# Altium project CFD_V1.03.PrjPcb (part 2 of 2)

## Sheet DIFF_DRV.SchDoc: ALICE FIT CFD Mezzanine
size 420 x 297 mm; CheckedBy: G.Kasprowicz; Author: INR Moscow; CompanyName: WUT ISE; DrawnBy: Maciej Podgóski; Organization: WUT ISE; Address1: PW ISE; Address2: Nowowiejska 15/19 00-665 Warsaw; Address3: gkasprow@gmail.com; DocumentNumber: 5; Revision: 2; SheetNumber: 5; SheetTotal: 5; ModifiedBy: -; CheckedDate: -; Title2: Differential driver; DivGrp: INR Moscow; Designer: INR Moscow; ModifiedDate: -; ProjectName: Sensor Box
Used 12 times, as channels DIFF_DRV1, DIFF_DRV2, DIFF_DRV3, DIFF_DRV4, DIFF_DRV5, DIFF_DRV6, DIFF_DRV7, DIFF_DRV8, DIFF_DRV9, DIFF_DRV10, DIFF_DRV11, DIFF_DRV12. Parts and nets are listed once, with the designators drawn on the sheet.
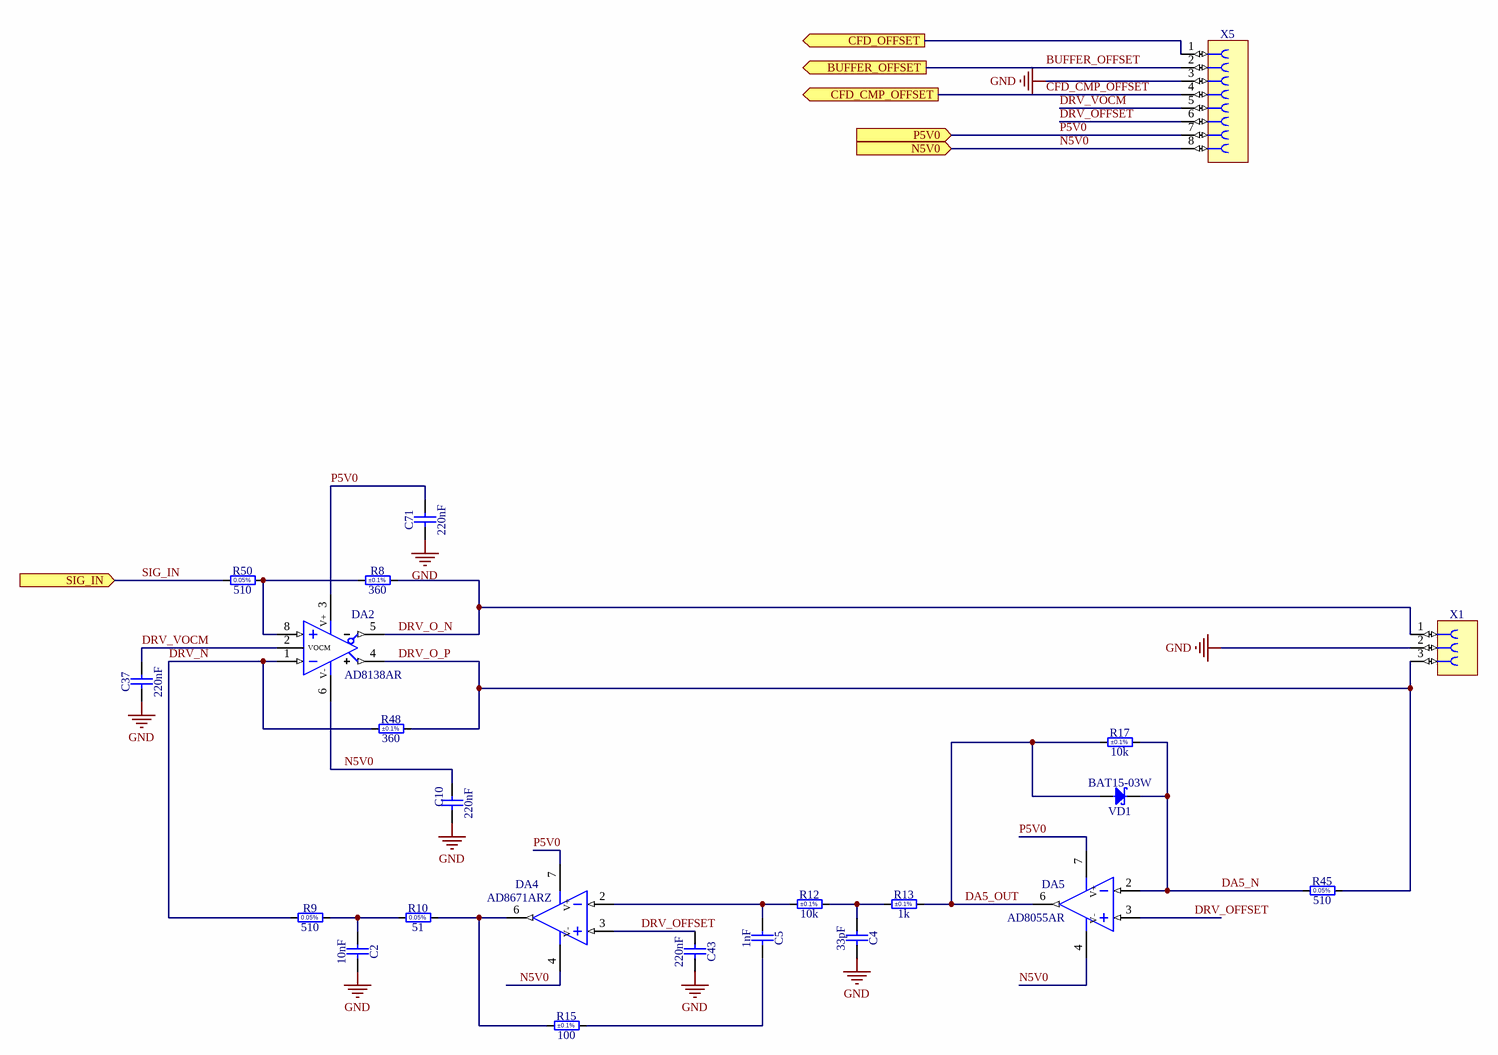
[diagram p3: DIFF_DRV.SchDoc]

### Parts
C2  10nF  [CAPC2012X135N]
C4  33pF  [CAPC2013X115N]
C5  1nF  [CAPC2013X100N]
C10  220nF  [CAPC2012X135N]
C37  220nF  [CAPC2012X135N]
C43  220nF  [CAPC2012X135N]
C71  220nF  [CAPC2012X135N]
DA2  AD8138AR  [SOIC127P600X175-8N]
DA4  AD8671ARZ  [SOIC127P600X175-8N]
DA5  AD8055AR  [SOIC127P600X175-8N]
R8  360  Tolerance: ±0.1%  [RESC2012X60N]
R9  510  [RESC1608X55N]
R10  51  [RESC2012X60N]
R12  10k  Tolerance: ±0.1%  [RESC2012X60N]
R13  1k  Tolerance: ±0.1%  [RESC2012X60N]
R15  100  Tolerance: ±0.1%  [RESC2012X60N]
R17  10k  Tolerance: ±0.1%  [RESC2012X60N]
R45  510  [RESC1608X55N]
R48  360  Tolerance: ±0.1%  [RESC2012X60N]
R50  510  [RESC1608X55N]
VD1  BAT15-03W  [SOD2512X110N]
X1  Socket 3  [SAMTEC_CES-103-01-T-S]  (value not drawn)
X5  Socket 8  [SAMTEC_CES-108-01-T-S]  (value not drawn)

### Ports
BUFFER_OFFSET (out), CFD_CMP_OFFSET (out), CFD_OFFSET (out), N5V0 (in), P5V0 (in), SIG_IN (in)

### Nets
GND: C2.1 C4.1 C10.1 C37.1 C43.1 C71.1 X1.2 X5.3
BUFFER_OFFSET: X5.2 ; port BUFFER_OFFSET
CFD_CMP_OFFSET: X5.4 ; port CFD_CMP_OFFSET
CFD_OFFSET: X5.1 ; port CFD_OFFSET
DA5_N: DA5.2(IN-) R17.1 R45.1 VD1.1(C)
DA5_OUT: DA5.6(OUT) R13.1 R17.2 VD1.2(A)
DRV_N: DA2.1(IN-) R9.2 R48.1
DRV_O_N: DA2.5(VOUT-) R8.2 X1.1
DRV_O_P: DA2.4(VOUT+) R45.2 R48.2 X1.3
DRV_OFFSET: C43.2 DA4.3(IN+) DA5.3(IN+) X5.6
DRV_VOCM: C37.2 DA2.2(VOCM) X5.5
N5V0: C10.2 DA2.6(V-) DA4.4(V-) DA5.4(V-) X5.8 ; port N5V0
P5V0: C71.2 DA2.3(V+) DA4.7(V+) DA5.7(V+) X5.7 ; port P5V0
SIG_IN: R50.1 ; port SIG_IN
NetC2_2: C2.2 R9.1 R10.2
NetC4_2: C4.2 R12.1 R13.2
NetC5_1: C5.1 R15.1
NetC5_2: C5.2 DA4.2(IN-) R12.2
NetDA2_8: DA2.8(IN+) R8.1 R50.2
NetDA4_6: DA4.6(OUT) R10.1 R15.2

### Channels
DIFF_DRV1: designators end in A; ports BUFFER_OFFSET=BUFFER_OFFSET CFD_CMP_OFFSET=CFD_CMP_OFFSET CFD_OFFSET=CFD_OFFSET N5V0=N5V0 P5V0=P5V0 SIG_IN=SIG_IN
DIFF_DRV2: designators end in B; ports BUFFER_OFFSET=BUFFER_OFFSET CFD_CMP_OFFSET=CFD_CMP_OFFSET CFD_OFFSET=CFD_OFFSET N5V0=N5V0 P5V0=P5V0 SIG_IN=SIG_IN
DIFF_DRV3: designators end in C; ports BUFFER_OFFSET=BUFFER_OFFSET CFD_CMP_OFFSET=CFD_CMP_OFFSET CFD_OFFSET=CFD_OFFSET N5V0=N5V0 P5V0=P5V0 SIG_IN=SIG_IN
DIFF_DRV4: designators end in D; ports BUFFER_OFFSET=BUFFER_OFFSET CFD_CMP_OFFSET=CFD_CMP_OFFSET CFD_OFFSET=CFD_OFFSET N5V0=N5V0 P5V0=P5V0 SIG_IN=SIG_IN
DIFF_DRV5: designators end in E; ports BUFFER_OFFSET=BUFFER_OFFSET CFD_CMP_OFFSET=CFD_CMP_OFFSET CFD_OFFSET=CFD_OFFSET N5V0=N5V0 P5V0=P5V0 SIG_IN=SIG_IN
DIFF_DRV6: designators end in F; ports BUFFER_OFFSET=BUFFER_OFFSET CFD_CMP_OFFSET=CFD_CMP_OFFSET CFD_OFFSET=CFD_OFFSET N5V0=N5V0 P5V0=P5V0 SIG_IN=SIG_IN
DIFF_DRV7: designators end in G; ports BUFFER_OFFSET=BUFFER_OFFSET CFD_CMP_OFFSET=CFD_CMP_OFFSET CFD_OFFSET=CFD_OFFSET N5V0=N5V0 P5V0=P5V0 SIG_IN=SIG_IN
DIFF_DRV8: designators end in H; ports BUFFER_OFFSET=BUFFER_OFFSET CFD_CMP_OFFSET=CFD_CMP_OFFSET CFD_OFFSET=CFD_OFFSET N5V0=N5V0 P5V0=P5V0 SIG_IN=SIG_IN
DIFF_DRV9: designators end in I; ports BUFFER_OFFSET=BUFFER_OFFSET CFD_CMP_OFFSET=CFD_CMP_OFFSET CFD_OFFSET=CFD_OFFSET N5V0=N5V0 P5V0=P5V0 SIG_IN=SIG_IN
DIFF_DRV10: designators end in J; ports BUFFER_OFFSET=BUFFER_OFFSET CFD_CMP_OFFSET=CFD_CMP_OFFSET CFD_OFFSET=CFD_OFFSET N5V0=N5V0 P5V0=P5V0 SIG_IN=SIG_IN
DIFF_DRV11: designators end in K; ports BUFFER_OFFSET=BUFFER_OFFSET CFD_CMP_OFFSET=CFD_CMP_OFFSET CFD_OFFSET=CFD_OFFSET N5V0=N5V0 P5V0=P5V0 SIG_IN=SIG_IN
DIFF_DRV12: designators end in L; ports BUFFER_OFFSET=BUFFER_OFFSET CFD_CMP_OFFSET=CFD_CMP_OFFSET CFD_OFFSET=CFD_OFFSET N5V0=N5V0 P5V0=P5V0 SIG_IN=SIG_IN

### Notes on the sheet
- Project/Equipment
- Document
- Designer
- Drawn by
- Check.by
- Copyright WUT ISE 2024.
  This documentation describes Open Hardware and is licensed under the CERN OHL v.2. You may redistribute and modify this documentation under the terms of the CERN OHL v.2. (http://ohwr.org/CERNOHL). This documentation is distributed WITHOUT ANY EXPRESS OR IMPLIED WARRANTY, INCLUDING OF MERCHANTABILITY, SATISFACTORY QUALITY AND FITNESS FOR A PARTICULAR PURPOSE. Please see the CERN OHL v.2 for applicable conditions.
- Contact
- File
- Last Mod.
- Print Date
- Sheet
- Size
- A3
- of
- Rev
- (in symbol R0603_510R_0.1%_0.1W_10PPM) 0.05%
- (in symbol R0805_51R_0.05%_0.125W_10PPM) 0.05%

### Library data of the parts
C2 = CC0805_10NF_50V_2%_C0G: Non-polarised capacitor; Part Description: SMD Multilayer Chip Ceramic Capacitor; Manufacturer: GENERIC; Manufacturer1 Part Number: 0805N103G500CT; Voltage: 50V; TC: C0G/NP0; Tolerance: ±2%; Part Number: CC0805_10NF_50V_2%_C0G; Component Kind: Standard; Component Type: Standard; Pin Count: 2; Value: 10nF; Status: None; Manufacturer Part Number: CC0805_10NF_50V_2%_C0G; Case: 0805; Mounted: Yes; Socket: No; SMD: Yes; Sense: No; Manufacturer1 Example: Walsin Technology Corporation; Manufacturer1 ComponentHeight: 1.35mm; HelpURL: \\cern.ch\dfs\Applications\Altium\Datasheets\CC0805_C0G_Walsin.pdf; Author: CERN DEM HF; CreateDate: 15.04.2024; LatestRevisionDate: 15.04.2024
C4 = CC0805_33PF_200V_1%_NP0: Non-polarised capacitor; Part Description: SMD Multilayer Chip Ceramic Capacitor; Manufacturer: GENERIC; Manufacturer1 Part Number: KGQ21HCG2D330FT; Voltage: 200V; TC: C0G/NP0; Tolerance: ±1%; Part Number: CC0805_33PF_200V_1%_NP0; Component Kind: Standard; Component Type: Standard; Pin Count: 2; Value: 33pF; Status: None; Manufacturer Part Number: CC0805_33PF_200V_1%_NP0; Case: 0805; Mounted: Yes; Socket: No; SMD: Yes; Sense: No; Manufacturer1 Example: AVX; Manufacturer1 ComponentHeight: 1.15mm; HelpURL: \\cern.ch\dfs\Applications\Altium\Datasheets\CC0805_NP0_AVX_KGQ.pdf; Author: CERN DEM HF; CreateDate: 15.04.2024; LatestRevisionDate: 15.04.2024
C5 = CC0805_1NF_25V_1%_C0G: Non-polarised capacitor; Part Description: SMD Multilayer Chip Ceramic Capacitor; Manufacturer: GENERIC; Manufacturer1 Part Number: C0805C102F3GACTU; Voltage: 25V; TC: C0G/NP0; Tolerance: ±1%; Part Number: CC0805_1NF_25V_1%_C0G; Component Kind: Standard; Component Type: Standard; Pin Count: 2; Value: 1nF; Status: None; Manufacturer Part Number: CC0805_1NF_25V_1%_C0G; Case: 0805; Mounted: Yes; Socket: No; SMD: Yes; Sense: No; Manufacturer1 Example: KEMET; Manufacturer1 ComponentHeight: 0.88mm; HelpURL: \\cern.ch\dfs\Applications\Altium\Datasheets\CC0805_C0G_KEMET_(Commercial Grade).pdf; Author: CERN DEM JLC; CreateDate: 11.03.2015; LatestRevisionDate: 11.03.2015
C10 C37 C43 C71 = CC0805_220NF_50V_10%_X7R: Non-polarised capacitor; Part Description: SMD Multilayer Chip Ceramic Capacitor; Manufacturer: GENERIC; Manufacturer1 Part Number: GRM21BR71H224KA01L; Voltage: 50V; TC: X7R; Tolerance: ±10%; Part Number: CC0805_220NF_50V_10%_X7R; Component Kind: Standard; Component Type: Standard; Pin Count: 2; Value: 220nF; Status: Preferred; Manufacturer Part Number: CC0805_220NF_50V_10%_X7R; Case: 0805; Mounted: Yes; Socket: No; SMD: Yes; Sense: No; Manufacturer1 Example: MURATA; Manufacturer1 ComponentHeight: 1.35mm; HelpURL: \\cern.ch\dfs\Applications\Altium\Datasheets\CC0805_X7R_MURATA.pdf; Author: CERN DEM JLC; CreateDate: 03.12.2007; LatestRevisionDate: 03.12.2007
DA2 = AD8138AR: Differential Amplifier; Part Description: Low Distortion Differential ADC Driver; Manufacturer: ANALOG DEVICES; PressFit: No; Bonding: No; Part Number: AD8138AR; Component Kind: Standard; Component Type: Standard; Device: AD8138AR; PackageDescription: SOIC 8, Pitch 1.27mm - Body 4x5mm, IPC Medium Density; Status: Not recommended; Manufacturer Part Number: AD8138AR; Pin Count: 7; Case: SOIC8; Mounted: Yes; Socket: No; SMD: Yes; Sense: No; ComponentHeight: 1.75mm; Author: CERN DEM JLC; HelpURL: \\cern.ch\dfs\Applications\Altium\Datasheets\AD8138AR.pdf; CreateDate: 24.11.2008; LatestRevisionDate: 24.11.2008
DA4 = AD8671ARZ: Operational Amplifier; Part Description: Precision, Very Low Noise, Low Input Bias Current Operational Amplifier; Manufacturer: ANALOG DEVICES; PressFit: No; Bonding: No; Part Number: AD8671ARZ; Component Kind: Standard; Component Type: Standard; Device: AD8671ARZ; PackageDescription: SOIC 8, Pitch 1.27mm - Body 4x5mm, IPC Medium Density; Manufacturer Part Number: AD8671AR; Pin Count: 8; Case: SOIC8; Mounted: Yes; Socket: No; SMD: Yes; Sense: No; ComponentHeight: 1.75mm; Author: CERN DEM JLC; HelpURL: \\cern.ch\dfs\Applications\Altium\Datasheets\AD8671ARZ.pdf; CreateDate: 17.06.2014; LatestRevisionDate: 31.03.2022
DA5 = AD8055AR: Operational Amplifier; Part Description: Low Cost, 300 MHz Voltage Feedback Amplifier; Manufacturer: ANALOG DEVICES; PressFit: No; Bonding: No; Part Number: AD8055AR; Component Kind: Standard; Component Type: Standard; Device: AD8055AR; PackageDescription: SOIC 8, Pitch 1.27mm - Body 4x5mm, IPC Medium Density; Manufacturer Part Number: AD8055AR; Pin Count: 8; Case: SOIC8; Mounted: Yes; Socket: No; SMD: Yes; Sense: No; ComponentHeight: 1.75mm; Author: CERN DEM HF; HelpURL: \\cern.ch\dfs\Applications\Altium\Datasheets\AD8055.pdf; CreateDate: 15.04.2024; LatestRevisionDate: 15.04.2024
R8 R48 = R0805_360R_0.1%_0.125W_10PPM: Resistor - 0.1%; Part Description: Thin Film Chip Resistor; Manufacturer: GENERIC; Manufacturer1 Part Number: RT0805BRB07360RL; Power: 0.125W; TC: ±10ppm; PressFit: No; Part Number: R0805_360R_0.1%_0.125W_10PPM; Component Kind: Standard; Component Type: Standard; Pin Count: 2; Value: 360; Status: Not Recommended; Manufacturer Part Number: R0805_360R_0.1%_0.125W_10PPM; Case: 0805; Mounted: Yes; Sense: No; Socket: No; SMD: Yes; Manufacturer1 Example: YAGEO PHYCOMP; Manufacturer1 ComponentHeight: 0.6mm; HelpURL: \\cern.ch\dfs\Applications\Altium\Datasheets\R0805_YAGEO_RT.pdf; Author: CERN DEM HF; CreateDate: 11.07.2022; LatestRevisionDate: 11.07.2022
R9 R45 R50 = R0603_510R_0.1%_0.1W_10PPM: Resistor - 0.05%; Part Description: Thin Film Chip Resistor; Manufacturer: GENERIC; Manufacturer1 Part Number: RG1608N-511-W-T1; Power: 0.1W; TC: ±10ppm/°C; Tolerance: ±0.1%; PressFit: No; Part Number: R0603_510R_0.1%_0.1W_10PPM; Component Kind: Standard; Component Type: Standard; Pin Count: 2; Value: 510; Status: Not Recommended; Manufacturer Part Number: R0603_510R_0.1%_0.1W_10PPM; Case: 0805; Mounted: Yes; Sense: No; Socket: No; SMD: Yes; Manufacturer1 Example: SUSUMU; Manufacturer1 ComponentHeight: 0.5mm; HelpURL: \\cern.ch\dfs\Applications\Altium\Datasheets\R0603_SUSUMU_RG.pdf; Author: CERN DEM HF; CreateDate: 25.04.2024; LatestRevisionDate: 25.04.2024
R10 = R0805_51R_0.05%_0.125W_10PPM: Resistor - 0.05%; Part Description: Thin Film Chip Resistor; Manufacturer: GENERIC; Manufacturer1 Part Number: RG2012N-510-W-T1; Power: 0.1W; TC: ±10ppm/°C; Tolerance: ±0.1%; PressFit: No; Part Number: R0805_51R_0.05%_0.125W_10PPM; Component Kind: Standard; Component Type: Standard; Pin Count: 2; Value: 51; Status: Not Recommended; Manufacturer Part Number: R0805_51R_0.05%_0.125W_10PPM; Case: 0805; Mounted: Yes; Sense: No; Socket: No; SMD: Yes; Manufacturer1 Example: SUSUMU; Manufacturer1 ComponentHeight: 0.5mm; HelpURL: \\cern.ch\dfs\Applications\Altium\Datasheets\R0805_SUSUMU_RG.pdf; Author: CERN DEM HF; CreateDate: 25.04.2024; LatestRevisionDate: 25.04.2024
R12 R17 = R0805_10K_0.1%_0.1W_10PPM: Resistor - 0.1%; Part Description: Thin Film Chip Resistor; Manufacturer: GENERIC; Manufacturer1 Part Number: RN73C2A10KBTG; Power: 0.1W; TC: ±10ppm; PressFit: No; Part Number: R0805_10K_0.1%_0.1W_10PPM; Component Kind: Standard; Component Type: Standard; Pin Count: 2; Value: 10k; Status: Not Recommended; Manufacturer Part Number: R0805_10K_0.1%_0.1W_10PPM; Case: 0805; Mounted: Yes; Sense: No; Socket: No; SMD: Yes; Manufacturer1 Example: TYCO HOLSWORTHY; Manufacturer1 ComponentHeight: 0.6mm; HelpURL: \\cern.ch\dfs\Applications\Altium\Datasheets\R0805_Tyco_RN73.pdf; Author: CERN DEM JLC; CreateDate: 03.12.2007; LatestRevisionDate: 13.03.2008
R13 = R0805_1K_0.1%_0.1W_10PPM: Resistor - 0.1%; Part Description: Thin Film Chip Resistor; Manufacturer: GENERIC; Manufacturer1 Part Number: RN73C2A1K0BTG; Power: 0.1W; TC: ±10ppm; PressFit: No; Part Number: R0805_1K_0.1%_0.1W_10PPM; Component Kind: Standard; Component Type: Standard; Pin Count: 2; Value: 1k; Status: Not Recommended; Manufacturer Part Number: R0805_1K_0.1%_0.1W_10PPM; Case: 0805; Mounted: Yes; Sense: No; Socket: No; SMD: Yes; Manufacturer1 Example: TYCO HOLSWORTHY; Manufacturer1 ComponentHeight: 0.6mm; HelpURL: \\cern.ch\dfs\Applications\Altium\Datasheets\R0805_TYCO_RN73.pdf; Author: CERN DEM JLC; CreateDate: 28.05.2013; LatestRevisionDate: 28.05.2013
R15 = R0805_100R_0.1%_0.1W_10PPM: Resistor - 0.1%; Part Description: Thin Film Chip Resistor; Manufacturer: GENERIC; Manufacturer1 Part Number: RN73C2A100RBTG; Power: 0.1W; TC: ±10ppm; PressFit: No; Part Number: R0805_100R_0.1%_0.1W_10PPM; Component Kind: Standard; Component Type: Standard; Pin Count: 2; Value: 100; Status: Not Recommended; Manufacturer Part Number: R0805_100R_0.1%_0.1W_10PPM; Case: 0805; Mounted: Yes; Sense: No; Socket: No; SMD: Yes; Manufacturer1 Example: TYCO HOLSWORTHY; Manufacturer1 ComponentHeight: 0.6mm; HelpURL: \\cern.ch\dfs\Applications\Altium\Datasheets\R0805_Tyco_RN73.pdf; Author: CERN DEM JLC; CreateDate: 03.12.2007; LatestRevisionDate: 13.03.2008
VD1 = BAT15-03W: Schottky Diode; Part Description: Single Silicon RF Schottky Diode; Manufacturer: INFINEON; Device: BAT60A; Voltage: 4V; Power: 100mA; PressFit: No; Bonding: No; Part Number: BAT15-03W; Component Kind: Standard; Component Type: Standard; PackageDescription: Small Outline Diode (SOD-323), 1.70mm W X 1.25mm L X 1.10mm H body,  IPC Medium Density; Manufacturer Part Number: BAT15-03W; Pin Count: 2; Case: SOD-323; Mounted: Yes; Socket: No; SMD: Yes; Sense: No; ComponentHeight: 1.1mm; HelpURL: \\cern.ch\dfs\Applications\Altium\Datasheets\BAT15-03W.pdf; Author: CERN DEM HF; CreateDate: 15.04.2024; LatestRevisionDate: 15.04.2024
X1 = SAMTEC_CES-103-01-L-S: Connector 3 Female; Part Description: 3 Contacts, Pitch 2.54mm, Single Row Through Mount Straight Socket (Lead Length 3.25mm); Manufacturer: SAMTEC; PressFit: No; Part Number: SAMTEC_CES-103-01-L-S; Component Kind: Standard; Component Type: Standard; Pin Count: 3; Family: Socket 3; Mounted: Yes; Socket: No; SMD: No; Sense: No; Status: None; Manufacturer Part Number: CES-103-01-L-S; ComponentHeight: 5.08mm; HelpURL: \\cern.ch\dfs\Applications\Altium\Datasheets\SAMTEC_CES-103-01-T-S.pdf; Author: CERN DEM HF; CreateDate: 25.04.2024; LatestRevisionDate: 25.04.2024
X5 = SAMTEC_CES-108-01-L-S: Connector 8 Female; Part Description: 8 Contacts, Pitch 2.54mm, Single Row Through Mount Straight Socket (Lead Length 3.25mm); Manufacturer: SAMTEC; PressFit: No; Part Number: SAMTEC_CES-108-01-L-S; Component Kind: Standard; Component Type: Standard; Pin Count: 8; Family: Socket 8; Mounted: Yes; Socket: No; SMD: No; Sense: No; Status: None; Manufacturer Part Number: CES-108-01-L-S; ComponentHeight: 5.08mm; HelpURL: \\cern.ch\dfs\Applications\Altium\Datasheets\SAMTEC_CES-108-01-T-S.pdf; Author: CERN DEM HF; CreateDate: 25.04.2024; LatestRevisionDate: 25.04.2024

## Sheet CFD_Timing.SchDoc: ALICE FIT CFD Mezzanine
size 420 x 297 mm; CheckedBy: G.Kasprowicz; Author: INR Moscow; CompanyName: WUT ISE; DrawnBy: Maciej Podgóski; Organization: WUT ISE; Address1: PW ISE; Address2: Nowowiejska 15/19 00-665 Warsaw; Address3: gkasprow@gmail.com; DocumentNumber: 2; Revision: 2; SheetNumber: 2; SheetTotal: 5; ModifiedBy: -; CheckedDate: -; Title2: Constant Fraction Disciriminator; DivGrp: WUT ISE; Designer: INR Moscow; ModifiedDate: -; ProjectName: Sensor Box
Used 12 times, as channels CFD_T1, CFD_T2, CFD_T3, CFD_T4, CFD_T5, CFD_T6, CFD_T7, CFD_T8, CFD_T9, CFD_T10, CFD_T11, CFD_T12. Parts and nets are listed once, with the designators drawn on the sheet.
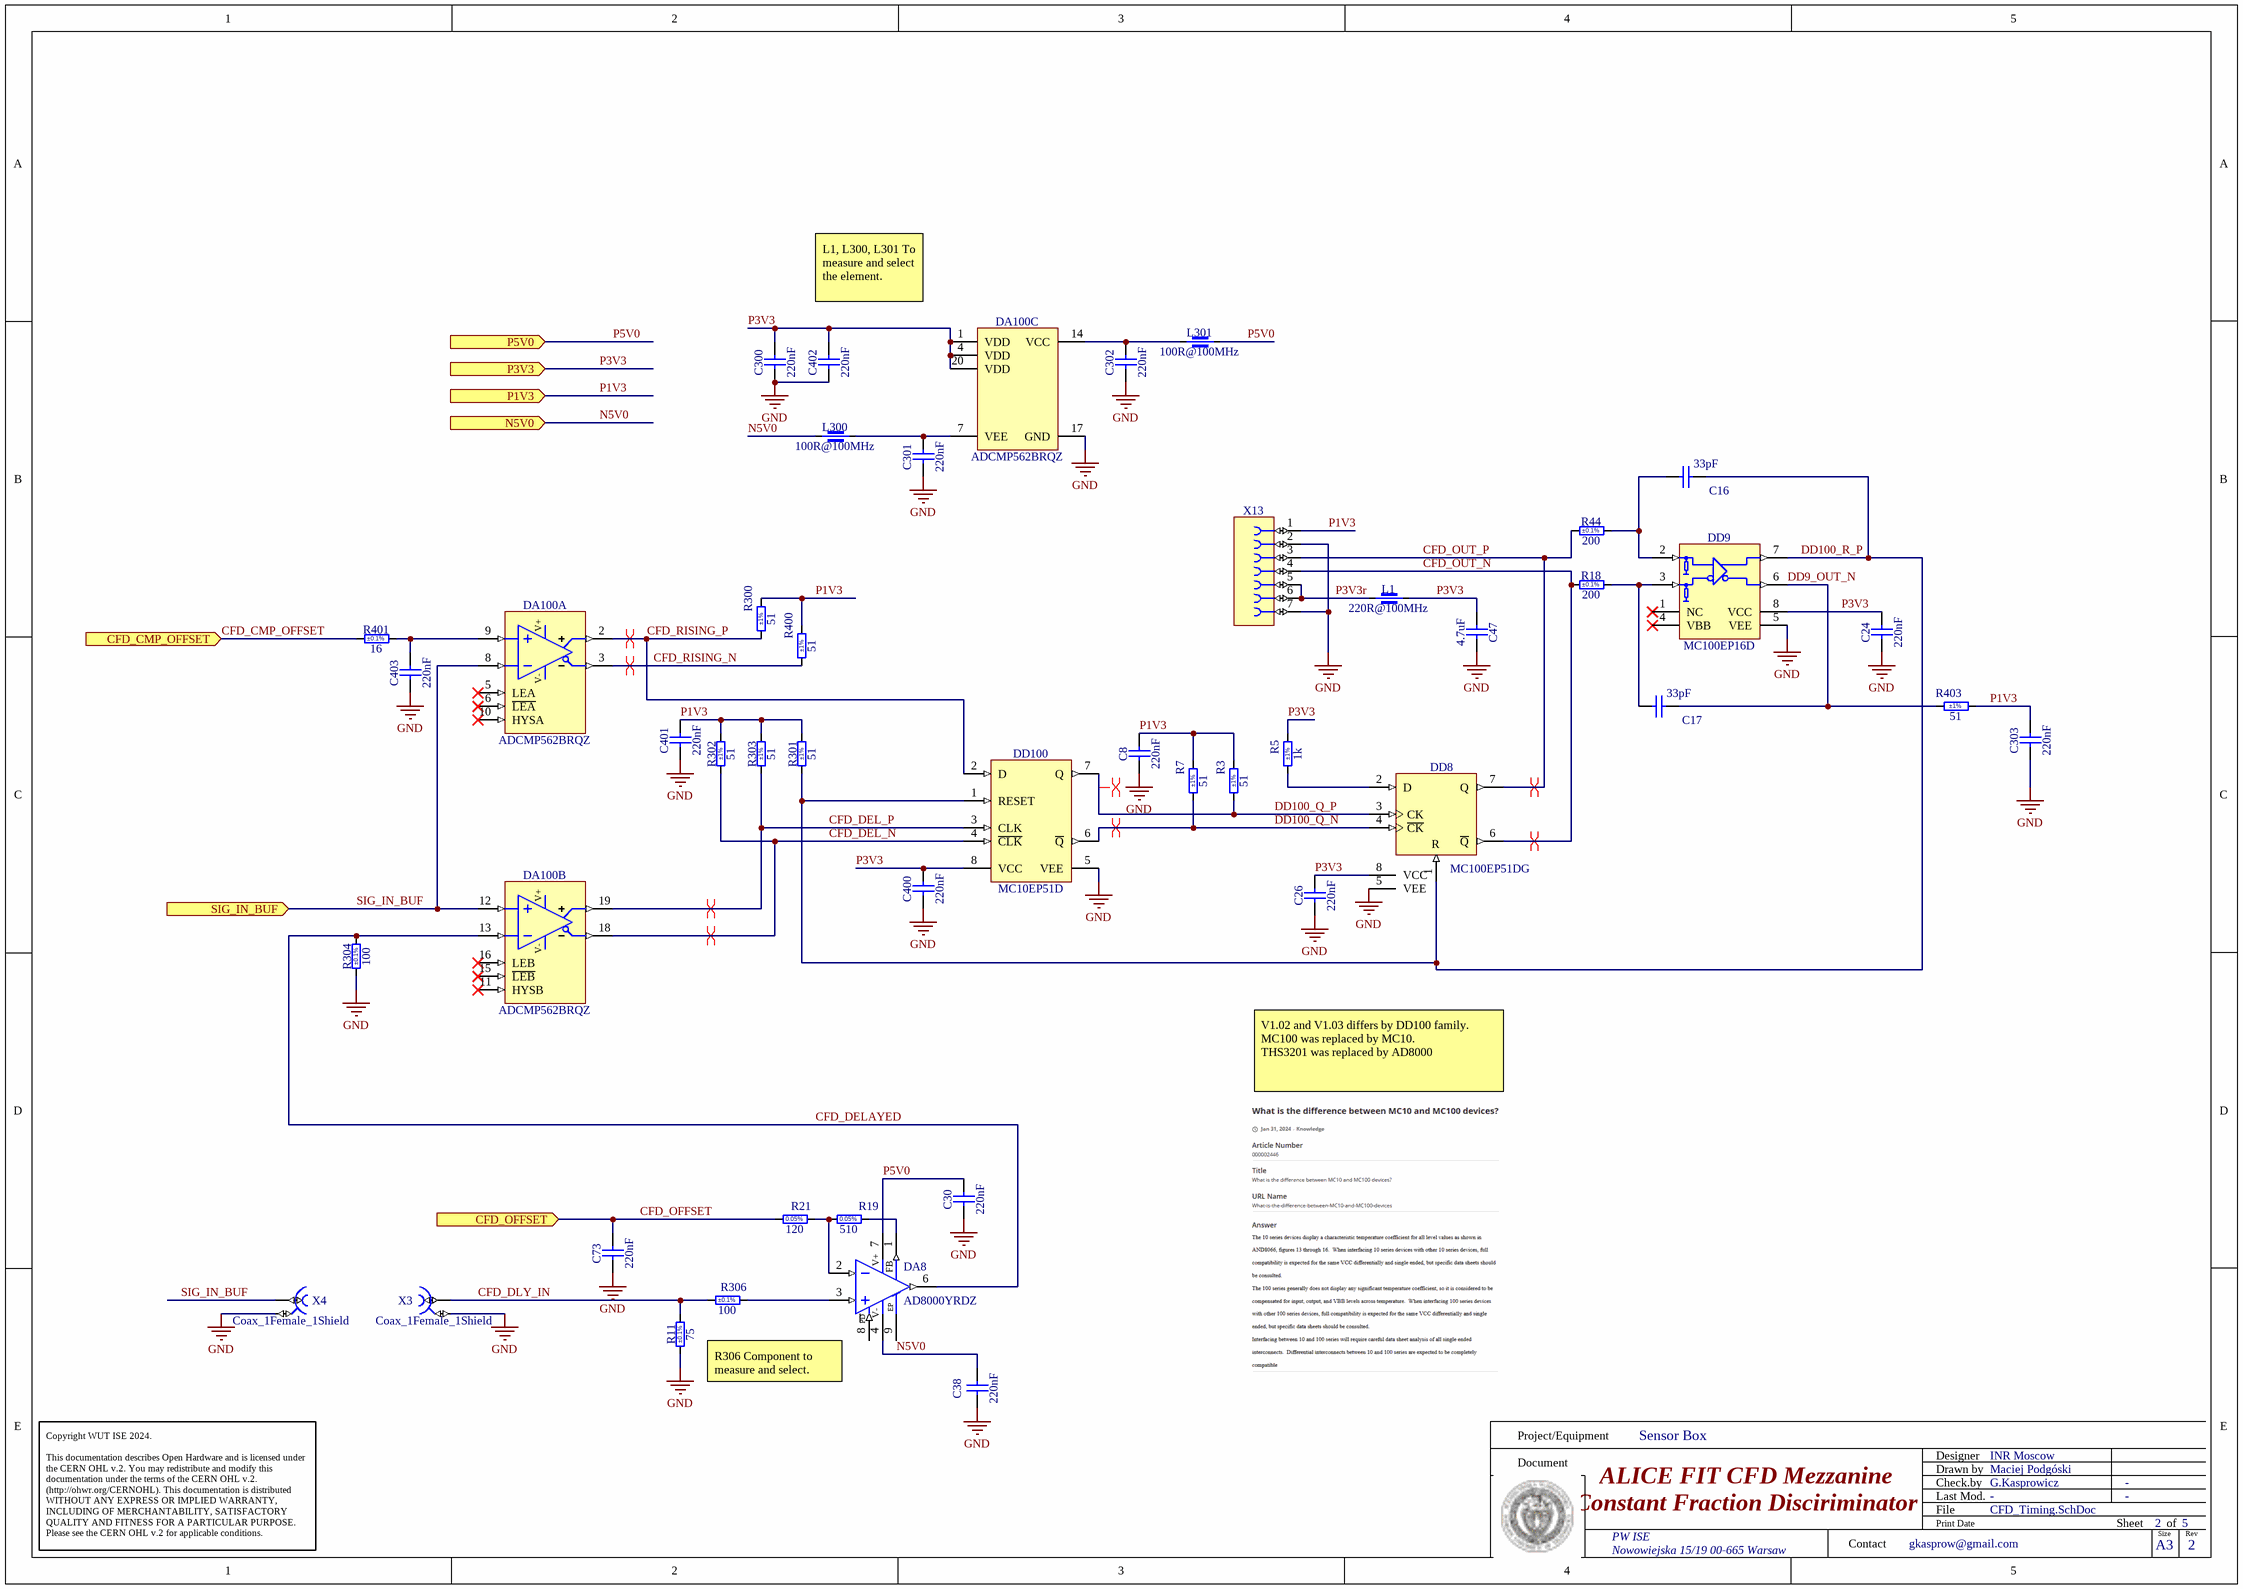
[diagram p4: CFD_Timing.SchDoc]

### Parts
C8  220nF  [CAPC2012X135N]
C16  33pF  [CAPC2012X135N]
C17  33pF  [CAPC2012X135N]
C24  220nF  [CAPC2012X135N]
C26  220nF  [CAPC2012X135N]
C30  220nF  [CAPC2012X135N]
C38  220nF  [CAPC2012X135N]
C47  4.7uF  [CAPC3216X180N]
C73  220nF  [CAPC2012X135N]
C300  220nF  [CAPC1608X87N]
C301  220nF  [CAPC1608X87N]
C302  220nF  [CAPC1608X87N]
C303  220nF  [CAPC2012X135N]
C400  220nF  [CAPC2012X135N]
C401  220nF  [CAPC2012X135N]
C402  220nF  [CAPC1608X87N]
C403  220nF  [CAPC1608X87N]
DA8  AD8000YRDZ  [SOIC127P600X175-9N-S229]
DA100  ADCMP562BRQZ  [SOP63P600X175-20AN]  (parts A,B,C of 3)
DD8  MC100EP51DG  [SOIC127P600X175-8N]
DD9  MC100EP16D  [SOIC127P600X175-8N]
DD100  MC10EP51D  [SOP65P490X110-8N]
L1  220R@100MHz  [INDC2012X105N]
L300  100R@100MHz  [INDC1608X75N]
L301  100R@100MHz  [INDC1608X75N]
R3  51  Tolerance: ±1%  [RESC2012X60N]
R5  1k  Tolerance: ±1%  [RESC2012X60N]
R7  51  Tolerance: ±1%  [RESC2012X60N]
R11  75  Tolerance: ±0.1%  [RESC1608X55N]
R18  200  Tolerance: ±0.1%  [RESC2012X60N]
R19  510  [RESC1608X55N]
R21  120  [RESC1608X55N]
R44  200  Tolerance: ±0.1%  [RESC2012X60N]
R300  51  Tolerance: ±1%  [RESC2012X60N]
R301  51  Tolerance: ±1%  [RESC2012X60N]
R302  51  Tolerance: ±1%  [RESC2012X60N]
R303  51  Tolerance: ±1%  [RESC2012X60N]
R304  100  Tolerance: ±0.1%  [RESC1608X55N]
R306  100  Tolerance: ±0.1%  [RESC1005X35N]
R400  51  Tolerance: ±1%  [RESC2012X60N]
R401  16  Tolerance: ±0.1%  [RESC1608X64N]
R403  51  Tolerance: ±1%  [RESC2012X60N]
X3  Coax_1Female_1Shield  [SAMTEC_MMCX-J-P-H-ST-TH1]
X4  Coax_1Female_1Shield  [SAMTEC_MMCX-J-P-H-ST-TH1]
X13  Socket 7  [SAMTEC_CES-107-01-T-S]  (value not drawn)

### Ports
CFD_CMP_OFFSET (in), CFD_OFFSET (in), N5V0 (in), P1V3 (in), P3V3 (in), P5V0 (in), SIG_IN_BUF (in)

### Nets
GND: C8.1 C24.1 C26.1 C30.1 C38.1 C47.1 C73.1 C300.1 C301.1 C302.1 C303.1 C400.1 C401.1 C402.1 C403.1 DA100.17(GND) DD8.5(VEE) DD9.5(VEE) DD100.5(VEE) R11.1 R304.1 X3.2 X4.2 X13.2 X13.7
CFD_CMP_OFFSET: R401.1 ; port CFD_CMP_OFFSET
CFD_DEL_N: DA100.18(~{QB}) DD100.4(~{CLK}) R302.1
CFD_DEL_P: DA100.19(QB) DD100.3(CLK) R303.1
CFD_DELAYED: DA8.6(OUT) DA100.13(-INB) R304.2
CFD_DLY_IN: R11.2 R306.1 X3.1
CFD_OFFSET: C73.2 R21.1 ; port CFD_OFFSET
CFD_OUT_N: DD8.6(~{Q}) R18.1 X13.4
CFD_OUT_P: DD8.7(Q) R44.1 X13.3
CFD_RISING_N: DA100.3(~{QA}) R400.1
CFD_RISING_P: DA100.2(QA) DD100.2(D) R300.1
DD9_OUT_N: C17.1 DD9.6(~{Q}) R403.1
DD100_Q_N: DD8.4(~{CK}) DD100.6(~{Q}) R7.1
DD100_Q_P: DD8.3(CK) DD100.7(Q) R3.1
DD100_R_P: C16.1 DD8.1(R) DD9.7(Q) DD100.1(RESET) R301.1
N5V0: C38.2 DA8.4(V-) L300.1 ; port N5V0
P1V3: C8.2 C303.2 C401.2 R3.2 R7.2 R300.2 R301.2 R302.2 R303.2 R400.2 R403.2 X13.1 ; port P1V3
P3V3: C24.2 C26.2 C47.2 C300.2 C400.2 C402.2 DA100.1(VDD) DA100.4(VDD) DA100.20(VDD) DD8.8(VCC) DD9.8(VCC) DD100.8(VCC) L1.1 R5.2 ; port P3V3
P3V3r: L1.2 X13.5 X13.6
P5V0: C30.2 DA8.7(V+) L301.2 ; port P5V0
SIG_IN_BUF: DA100.8(-INA) DA100.12(+INB) X4.1 ; port SIG_IN_BUF
NetC16_2: C16.2 DD9.2(D0) R44.2
NetC17_2: C17.2 DD9.3(~{D0}) R18.2
NetC301_2: C301.2 DA100.7(VEE) L300.2
NetC302_2: C302.2 DA100.14(VCC) L301.1
NetC403_2: C403.2 DA100.9(+INA) R401.2
NetDA8_1: DA8.1(FB) R19.2
NetDA8_2: DA8.2(IN-) R19.1 R21.2
NetDA8_3: DA8.3(IN+) R306.2
NetDD8_2: DD8.2(D) R5.1

Not connected (* = marked no-connect by the designer): DA8 8(~{DS}) 9(EP); DA100 5(LEA)* 6(~{LEA})* 10(HYSA)* 11(HYSB)* 15(~{LEB})* 16(LEB)*; DD9 1(NC)* 4(VBB)*

### Channels
CFD_T1: designators end in A; ports CFD_CMP_OFFSET=CFD_CMP_OFFSET CFD_OFFSET=CFD_OFFSET N5V0=N5V0 P1V3=P1V3 P3V3=P3V3 P5V0=P5V0 SIG_IN_BUF=SIG_IN_BUF
CFD_T2: designators end in B; ports CFD_CMP_OFFSET=CFD_CMP_OFFSET CFD_OFFSET=CFD_OFFSET N5V0=N5V0 P1V3=P1V3 P3V3=P3V3 P5V0=P5V0 SIG_IN_BUF=SIG_IN_BUF
CFD_T3: designators end in C; ports CFD_CMP_OFFSET=CFD_CMP_OFFSET CFD_OFFSET=CFD_OFFSET N5V0=N5V0 P1V3=P1V3 P3V3=P3V3 P5V0=P5V0 SIG_IN_BUF=SIG_IN_BUF
CFD_T4: designators end in D; ports CFD_CMP_OFFSET=CFD_CMP_OFFSET CFD_OFFSET=CFD_OFFSET N5V0=N5V0 P1V3=P1V3 P3V3=P3V3 P5V0=P5V0 SIG_IN_BUF=SIG_IN_BUF
CFD_T5: designators end in E; ports CFD_CMP_OFFSET=CFD_CMP_OFFSET CFD_OFFSET=CFD_OFFSET N5V0=N5V0 P1V3=P1V3 P3V3=P3V3 P5V0=P5V0 SIG_IN_BUF=SIG_IN_BUF
CFD_T6: designators end in F; ports CFD_CMP_OFFSET=CFD_CMP_OFFSET CFD_OFFSET=CFD_OFFSET N5V0=N5V0 P1V3=P1V3 P3V3=P3V3 P5V0=P5V0 SIG_IN_BUF=SIG_IN_BUF
CFD_T7: designators end in G; ports CFD_CMP_OFFSET=CFD_CMP_OFFSET CFD_OFFSET=CFD_OFFSET N5V0=N5V0 P1V3=P1V3 P3V3=P3V3 P5V0=P5V0 SIG_IN_BUF=SIG_IN_BUF
CFD_T8: designators end in H; ports CFD_CMP_OFFSET=CFD_CMP_OFFSET CFD_OFFSET=CFD_OFFSET N5V0=N5V0 P1V3=P1V3 P3V3=P3V3 P5V0=P5V0 SIG_IN_BUF=SIG_IN_BUF
CFD_T9: designators end in I; ports CFD_CMP_OFFSET=CFD_CMP_OFFSET CFD_OFFSET=CFD_OFFSET N5V0=N5V0 P1V3=P1V3 P3V3=P3V3 P5V0=P5V0 SIG_IN_BUF=SIG_IN_BUF
CFD_T10: designators end in J; ports CFD_CMP_OFFSET=CFD_CMP_OFFSET CFD_OFFSET=CFD_OFFSET N5V0=N5V0 P1V3=P1V3 P3V3=P3V3 P5V0=P5V0 SIG_IN_BUF=SIG_IN_BUF
CFD_T11: designators end in K; ports CFD_CMP_OFFSET=CFD_CMP_OFFSET CFD_OFFSET=CFD_OFFSET N5V0=N5V0 P1V3=P1V3 P3V3=P3V3 P5V0=P5V0 SIG_IN_BUF=SIG_IN_BUF
CFD_T12: designators end in L; ports CFD_CMP_OFFSET=CFD_CMP_OFFSET CFD_OFFSET=CFD_OFFSET N5V0=N5V0 P1V3=P1V3 P3V3=P3V3 P5V0=P5V0 SIG_IN_BUF=SIG_IN_BUF

### Layout directives
differential pair: CFD_DEL_N_CFD_T1, CFD_DEL_P_CFD_T1, CFD_OUT_N_CFD_T1, CFD_OUT_P_CFD_T1, CFD_RISING_N_CFD_T1, CFD_RISING_P_CFD_T1, DD100_Q_N_CFD_T1, DD100_Q_P_CFD_T1

### Notes on the sheet
- L1, L300, L301 To measure and select the element.
- V1.02 and V1.03 differs by DD100 family. MC100 was replaced by MC10.
  THS3201 was replaced by AD8000
- R306 Component to measure and select.
- Project/Equipment
- Document
- Designer
- Drawn by
- Check.by
- Copyright WUT ISE 2024.
  This documentation describes Open Hardware and is licensed under the CERN OHL v.2. You may redistribute and modify this documentation under the terms of the CERN OHL v.2. (http://ohwr.org/CERNOHL). This documentation is distributed WITHOUT ANY EXPRESS OR IMPLIED WARRANTY, INCLUDING OF MERCHANTABILITY, SATISFACTORY QUALITY AND FITNESS FOR A PARTICULAR PURPOSE. Please see the CERN OHL v.2 for applicable conditions.
- Contact
- File
- Last Mod.
- Print Date
- Sheet
- Size
- A3
- of
- Rev
- (in symbol AD8000YRDZ) PD
- (in symbol ADCMP562BRQZ, part A) V+; V-
- (in symbol ADCMP562BRQZ, part B) V+; V-
- (in symbol R0603_120R_0.05%_0.1W_10PPM) 0.05%
- (in symbol R0603_510R_0.1%_0.1W_10PPM) 0.05%

### Library data of the parts
C8 C24 C26 C30 C38 C73 C303 C400 C401 = CC0805_220NF_50V_10%_X7R: as C10 on sheet DIFF_DRV; Part Number: CC0805_220NF_50V_10%_X7R; Component Kind: Standard; Component Type: Standard; Pin Count: 2; Value: 220nF; Status: Preferred; Manufacturer Part Number: CC0805_220NF_50V_10%_X7R; Case: 0805; Mounted: Yes; Socket: No; SMD: Yes; Sense: No; Manufacturer1 Example: MURATA; Manufacturer1 ComponentHeight: 1.35mm; HelpURL: \\cern.ch\dfs\Applications\Altium\Datasheets\CC0805_X7R_MURATA.pdf; Author: CERN DEM JLC; CreateDate: 03.12.2007; LatestRevisionDate: 03.12.2007
C16 C17 = CC0805_33PF_50V_5%_NP0: Non-polarised capacitor; Part Description: SMD Multilayer Chip Ceramic Capacitor; Manufacturer: GENERIC; Manufacturer1 Part Number: 223886115339; Voltage: 50V; TC: C0G/NP0; Tolerance: ±5%; Part Number: CC0805_33PF_50V_5%_NP0; Component Kind: Standard; Component Type: Standard; Pin Count: 2; Value: 33pF; Status: Preferred; Manufacturer Part Number: CC0805_33PF_50V_5%_NP0; Case: 0805; Mounted: Yes; Socket: No; SMD: Yes; Sense: No; Manufacturer1 Example: PHYCOMP; Manufacturer1 ComponentHeight: 1.35mm; HelpURL: \\cern.ch\dfs\Applications\Altium\Datasheets\CC0805_NP0_PHYCOMP.pdf; Author: CERN DEM JLC; CreateDate: 03.12.2007; LatestRevisionDate: 03.12.2007
C47 = CC1206_4.7UF_25V_10%_X7R: Non-polarised capacitor; Part Description: SMD Multilayer Chip Ceramic Capacitor; Manufacturer: GENERIC; Manufacturer1 Part Number: C1206C475K3RAC; Voltage: 25V; TC: X7R; Tolerance: ±10%; Part Number: CC1206_4.7UF_25V_10%_X7R; Component Kind: Standard; Component Type: Standard; Pin Count: 2; Value: 4.7uF; Status: Preferred; Manufacturer Part Number: CC1206_4.7UF_25V_10%_X7R; Case: 1206; Mounted: Yes; Socket: No; SMD: Yes; Sense: No; Manufacturer1 Example: KEMET; Manufacturer1 ComponentHeight: 1.8mm; HelpURL: \\cern.ch\dfs\Applications\Altium\Datasheets\CC1206_X7R_KEMET.pdf; Author: CERN DEM WB; CreateDate: 25.07.2018; LatestRevisionDate: 25.07.2018
C300-C302 C402 C403 = CC0603_220NF_25V_10%_X7R: Non-polarised capacitor; Part Description: SMD Multilayer Chip Ceramic Capacitor; Manufacturer: GENERIC; Manufacturer1 Part Number: C0603C224K3RACTU; Voltage: 25V; TC: X7R; Tolerance: ±10%; Part Number: CC0603_220NF_25V_10%_X7R; Component Kind: Standard; Component Type: Standard; Pin Count: 2; Value: 220nF; Status: Preferred; Manufacturer Part Number: CC0603_220NF_25V_10%_X7R; Case: 0603; Mounted: Yes; Socket: No; SMD: Yes; Sense: No; Manufacturer1 Example: KEMET; Manufacturer1 ComponentHeight: 0.87mm; HelpURL: \\cern.ch\dfs\Applications\Altium\Datasheets\CC0603_X7R_KEMET.pdf; Author: CERN DEM JLC; CreateDate: 29.10.2014; LatestRevisionDate: 29.10.2014
DA8 = AD8000YRDZ: 1.5 GHz Ultrahigh Speed Operational Amplifier; Manufacturer: ANALOG DEVICES; PressFit: No; Bonding: No; Part Number: AD8000YRDZ; Component Kind: Standard; Component Type: Standard; Device: AD8000YRDZ; PackageDescription: SOIC, 1.27mm Pitch; 8 Pin, 3.90mm W X 4.90mm L X 1.75mm H body (w/Thermal Tab 2.29 X 2.29mm), IPC Medium Density; Part Description: 1.5 GHz Ultrahigh Speed Operational Amplifier; Manufacturer Part Number: AD8000YRD; Pin Count: 9; Case: SOIC8; Mounted: Yes; Socket: No; SMD: Yes; Sense: No; ComponentHeight: 1.75mm; Author: CERN DEM JLC; HelpURL: \\cern.ch\dfs\Applications\Altium\Datasheets\AD8000YRDZ.pdf; CreateDate: 14.05.2013; LatestRevisionDate: 29.03.2022
DA100 = ADCMP562BRQZ: Dual, High Speed PECL Comparators; Part Description: Dual High Speed PECL Comparators; Manufacturer: ANALOG DEVICES; PressFit: No; Bonding: No; Part Number: ADCMP562BRQZ; Component Kind: Standard; Component Type: Standard; Device: ADCMP562BRQZ; PackageDescription: SOP, 0.635mm Pitch; 20 Pin, 3.90mm W X 8.65mm L X 1.75mm H Body, IPC Medium Density; Manufacturer Part Number: ADCMP562BRQ; Pin Count: 20; Case: SSOP20; Mounted: Yes; Socket: No; SMD: Yes; Sense: No; ComponentHeight: 1.75mm; Author: CERN DEM MR; HelpURL: \\cern.ch\dfs\Applications\Altium\Datasheets\ADCMP562BRQZ.pdf; CreateDate: 15.02.2018; LatestRevisionDate: 31.03.2022
DD8 = MC100EP51DG: 3.3V/5V ECL D Flip-Flop with Reset and Differential Clock; Manufacturer: ON SEMICONDUCTOR; PressFit: No; Bonding: No; Part Number: MC100EP51DG; Component Kind: Standard; Component Type: Standard; Device: MC100EP51DG; PackageDescription: SOIC 8, Pitch 1.27mm - Body 4x5mm, IPC Medium Density; Part Description: 3.3V/5V ECL D Flip-Flop with Reset and Differential Clock; Manufacturer Part Number: MC100EP51D; Pin Count: 8; Case: SOIC8; Mounted: Yes; Socket: No; SMD: Yes; Sense: No; ComponentHeight: 1.75mm; Author: CERN DEM JLC; HelpURL: \\cern.ch\dfs\Applications\Altium\Datasheets\MC100EP51DG.pdf; CreateDate: 27.02.2013; LatestRevisionDate: 25.05.2022
DD9 = MC100EP16D: 3.3V / 5V ECL Differential Receiver/Driver with High Gain; Manufacturer: ON SEMICONDUCTOR; PressFit: No; Bonding: No; Part Number: MC100EP16D; Component Kind: Standard; Component Type: Standard; Device: MC100EP16D; PackageDescription: SOIC 8, Pitch 1.27mm - Body 4x5mm, IPC Medium Density; Part Description: 3.3V/5V ECL Differential Receiver/Driver; Manufacturer Part Number: MC100EP16D; Pin Count: 8; Case: SOIC8; Mounted: Yes; Socket: No; SMD: Yes; Sense: No; ComponentHeight: 1.75mm; Author: CERN DEM HF; HelpURL: \\cern.ch\dfs\Applications\Altium\Datasheets\MC100EP16.pdf; CreateDate: 30.09.2024; LatestRevisionDate: 30.09.2024
DD100 = MC10EP51DT: 3.3V/5V ECL D Flip-Flop with Reset and Differential Clock; Manufacturer: ON SEMICONDUCTOR; PressFit: No; Bonding: No; Part Number: MC10EP51DT; Component Kind: Standard; Component Type: Standard; Device: MC10EP51D; PackageDescription: SOP, 0.65mm pitch; 8 pin, 3.00mm W X 3.00mm L X 1.10mm H body, IPC Medium Density; Part Description: 3.3V/5V ECL D Flip-Flop with Reset and Differential Clock; Manufacturer Part Number: MC10EP51DT; Pin Count: 8; Case: TSSOP; Mounted: Yes; Socket: No; SMD: Yes; Sense: No; ComponentHeight: 1.1mm; Author: CERN DEM HF; HelpURL: \\cern.ch\dfs\Applications\Altium\Datasheets\MC10EP51.pdf; CreateDate: 01.10.2024; LatestRevisionDate: 01.10.2024
L1 = IND0805_TDK_MPZ2012S221A: Part Description: SMT Chip Bead for General Power Line (MPZ Series); Manufacturer: TDK; Power: 3A; Resistance: 0.04R; Tolerance: ±25%; Part Number: IND0805_TDK_MPZ2012S221A; Component Kind: Standard; Component Type: Standard; Pin Count: 2; Value: 220R@100MHz; Manufacturer Part Number: MPZ2012S221A; Case: 0805; Mounted: Yes; Socket: No; SMD: Yes; Sense: No; ComponentHeight: 1.05mm; HelpURL: \\cern.ch\dfs\Applications\Altium\Datasheets\IND0805_TDK_MPZ2012.pdf; Author: CERN DEM HF; CreateDate: 04.10.2021; LatestRevisionDate: 04.10.2021
L300 L301 = IND0603_TDK_MPZ1608S101ATAH0: Part Description: SMT Chip Bead for Power Line; Manufacturer: TDK; Power: 3A; Resistance: 0.03R; Tolerance: ±25%; Part Number: IND0603_TDK_MPZ1608S101ATAH0; Component Kind: Standard; Component Type: Standard; Pin Count: 2; Value: 100R@100MHz; Manufacturer Part Number: MPZ1608S101ATAH0; Case: 0603; Mounted: Yes; Socket: No; SMD: Yes; Sense: No; ComponentHeight: 0.75mm; HelpURL: \\cern.ch\dfs\Applications\Altium\Datasheets\IND0603_TDK_MPZ1608.pdf; Author: CERN DEM JMW; CreateDate: 09.07.2015; LatestRevisionDate: 25.10.2018
R3 R7 R300-R303 R400 R403 = R0805_51R_1%_0.125W_100PPM: Resistor - 1%; Part Description: General Purpose Thick Film Chip Resistor; Manufacturer: GENERIC; Manufacturer1 Part Number: NRC10F51R0TRF; Power: 0.125W; TC: ±100ppm/°C; PressFit: No; Part Number: R0805_51R_1%_0.125W_100PPM; Component Kind: Standard; Component Type: Standard; Pin Count: 2; Value: 51; Status: Preferred; Manufacturer Part Number: R0805_51R_1%_0.125W_100PPM; Case: 0805; Mounted: Yes; Sense: No; Socket: No; SMD: Yes; Manufacturer1 Example: NIC COMPONENT; Manufacturer1 ComponentHeight: 0.6mm; HelpURL: \\cern.ch\dfs\Applications\Altium\Datasheets\R0805_NIC_NRC.pdf; Author: CERN DEM JLC; CreateDate: 03.12.2007; LatestRevisionDate: 13.03.2008
R5 = R0805_1K_1%_0.125W_100PPM: Resistor - 1%; Part Description: General Purpose Thick Film Chip Resistor; Manufacturer: GENERIC; Manufacturer1 Part Number: NRC10F1001TRF; Power: 0.125W; TC: ±100ppm/°C; PressFit: No; Part Number: R0805_1K_1%_0.125W_100PPM; Component Kind: Standard; Component Type: Standard; Pin Count: 2; Value: 1k; Status: Preferred; Manufacturer Part Number: R0805_1K_1%_0.125W_100PPM; Case: 0805; Mounted: Yes; Sense: No; Socket: No; SMD: Yes; Manufacturer1 Example: NIC COMPONENT; Manufacturer1 ComponentHeight: 0.6mm; HelpURL: \\cern.ch\dfs\Applications\Altium\Datasheets\R0805_NIC_NRC.pdf; Author: CERN DEM JLC; CreateDate: 03.12.2007; LatestRevisionDate: 13.03.2008
R11 = R0603_75R_0.1%_0.063W_10PPM: Resistor - 0.1%; Part Description: Thin Film Chip Resistor; Manufacturer: GENERIC; Manufacturer1 Part Number: RN73C1J75RBTDF; Power: 0.063W; TC: ±10ppm; PressFit: No; Part Number: R0603_75R_0.1%_0.063W_10PPM; Component Kind: Standard; Component Type: Standard; Pin Count: 2; Value: 75; Status: Not Recommended; Manufacturer Part Number: R0603_75R_0.1%_0.063W_10PPM; Case: 0603; Mounted: Yes; Sense: No; Socket: No; SMD: Yes; Manufacturer1 Example: TYCO HOLSWORTHY; Manufacturer1 ComponentHeight: 0.5mm; HelpURL: \\cern.ch\dfs\Applications\Altium\Datasheets\R0603_Tyco_RN73.pdf; Author: CERN DEM JLC; CreateDate: 03.12.2007; LatestRevisionDate: 13.03.2008
R18 R44 = R0805_200R_0.1%_0.1W_10PPM: Resistor - 0.1%; Part Description: Thin Film Chip Resistor; Manufacturer: GENERIC; Manufacturer1 Part Number: RN73C2A200RBTG; Power: 0.1W; TC: ±10ppm; PressFit: No; Part Number: R0805_200R_0.1%_0.1W_10PPM; Component Kind: Standard; Component Type: Standard; Pin Count: 2; Value: 200; Status: Not Recommended; Manufacturer Part Number: R0805_200R_0.1%_0.1W_10PPM; Case: 0805; Mounted: Yes; Sense: No; Socket: No; SMD: Yes; Manufacturer1 Example: TYCO HOLSWORTHY; Manufacturer1 ComponentHeight: 0.6mm; HelpURL: \\cern.ch\dfs\Applications\Altium\Datasheets\R0805_Tyco_RN73.pdf; Author: CERN DEM JLC; CreateDate: 03.12.2007; LatestRevisionDate: 13.03.2008
R19 = R0603_510R_0.1%_0.1W_10PPM: as R9 on sheet DIFF_DRV; Part Number: R0603_510R_0.1%_0.1W_10PPM; Component Kind: Standard; Component Type: Standard; Pin Count: 2; Value: 510; Status: Not Recommended; Manufacturer Part Number: R0603_510R_0.1%_0.1W_10PPM; Case: 0805; Mounted: Yes; Sense: No; Socket: No; SMD: Yes; Manufacturer1 Example: SUSUMU; Manufacturer1 ComponentHeight: 0.5mm; HelpURL: \\cern.ch\dfs\Applications\Altium\Datasheets\R0603_SUSUMU_RG.pdf; Author: CERN DEM HF; CreateDate: 25.04.2024; LatestRevisionDate: 25.04.2024
R21 = R0603_120R_0.05%_0.1W_10PPM: Resistor - 0.05%; Part Description: Thin Film Chip Resistor; Manufacturer: GENERIC; Manufacturer1 Part Number: RG1608N-121-W-T1; Power: 0.1W; TC: ±10ppm/°C; PressFit: No; Part Number: R0603_120R_0.05%_0.1W_10PPM; Component Kind: Standard; Component Type: Standard; Pin Count: 2; Value: 120; Status: Not Recommended; Tolerance: ±0.05%; Manufacturer Part Number: R0603_120R_0.05%_0.1W_10PPM; Case: 0805; Mounted: Yes; Sense: No; Socket: No; SMD: Yes; Manufacturer1 Example: SUSUMU; Manufacturer1 ComponentHeight: 0.5mm; HelpURL: \\cern.ch\dfs\Applications\Altium\Datasheets\R0603_SUSUMU_RG.pdf; Author: CERN DEM HF; CreateDate: 25.04.2024; LatestRevisionDate: 25.04.2024
R304 = R0603_100R_0.1%_0.1W_10PPM_VISHAY_MCT: Resistor - 0.1%; Part Description: Precision Thin Film Chip Resistor; Manufacturer: VISHAY BEYSCHLAG; Manufacturer Part Number: MCT06030F1000B; Power: 0.1W; TC: ±10ppm/°C; PressFit: No; Part Number: R0603_100R_0.1%_0.1W_10PPM_VISHAY_MCT; Component Kind: Standard; Component Type: Standard; Pin Count: 2; Value: 100; Status: Not Recommended; Case: 0603; Mounted: Yes; Sense: No; Socket: No; SMD: Yes; ComponentHeight: 0.55mm; HelpURL: \\cern.ch\dfs\Applications\Altium\Datasheets\R0603_VISHAY_MCT-Precision.pdf; Author: CERN DEM BC; CreateDate: 25.08.2020; LatestRevisionDate: 28.06.2022
R306 = R0402_100R_0.1%_0.063W_25PPM: Resistor - 0.1%; Part Description: Thin Film Precision Resistor; Manufacturer: GENERIC; Manufacturer1 Part Number: CPF0402B100RE1; Power: 0.063W; TC: ±25ppm/°C; PressFit: No; Part Number: R0402_100R_0.1%_0.063W_25PPM; Component Kind: Standard; Component Type: Standard; Pin Count: 2; Value: 100; Status: Not Recommended; Manufacturer Part Number: R0402_100R_0.1%_0.063W_25PPM; Case: 0402; Mounted: Yes; Sense: No; Socket: No; SMD: Yes; Manufacturer1 Example: TE CONNECTIVITY; Manufacturer1 ComponentHeight: 0.35mm; HelpURL: \\cern.ch\dfs\Applications\Altium\Datasheets\R0402_TYCO_CPF.pdf; Author: CERN DEM JMW; CreateDate: 22.09.2015; LatestRevisionDate: 22.09.2015
R401 = R0603_16R_0.1%_0.1W_10PPM: Resistor - 0.1%; Part Description: Thin Film Chip Resistor; Manufacturer: GENERIC; Manufacturer1 Part Number: RT0603BRB0716RL; Power: 0.1W; TC: ±10ppm/°C; PressFit: No; Part Number: R0603_16R_0.1%_0.1W_10PPM; Component Kind: Standard; Component Type: Standard; Pin Count: 2; Value: 16; Status: Not Recommended; Manufacturer Part Number: R0603_16R_0.1%_0.1W_10PPM; Case: 0603; Mounted: Yes; Sense: No; Socket: No; SMD: Yes; Manufacturer1 Example: YAGEO; Manufacturer1 ComponentHeight: 0.55mm; HelpURL: \\cern.ch\dfs\Applications\Altium\Datasheets\R0603_YAGEO_RT.pdf; Author: CERN DEM HF; CreateDate: 25.04.2024; LatestRevisionDate: 25.04.2024
X3 X4 = SAMTEC_MMCX-J-P-H-ST-TH1: Part Description: Straight Through-hole 50 Ohms Micro Mini RF Jack, MMCX Series; Manufacturer: SAMTEC; PressFit: No; Part Number: SAMTEC_MMCX-J-P-H-ST-TH1; Component Kind: Standard; Component Type: Standard; Pin Count: 2; Mounted: Yes; Socket: No; SMD: No; Sense: No; Status: None; Manufacturer Part Number: MMCX-J-P-H-ST-TH1; ComponentHeight: 4.35mm; HelpURL: \\cern.ch\dfs\Applications\Altium\Datasheets\SAMTEC_MMCX-J-P-H-ST-TH1.pdf; Author: CERN DEM JLC; CreateDate: 05.12.2012; LatestRevisionDate: 05.12.2012
X13 = SAMTEC_CES-107-01-L-S: Connector 7 Female; Part Description: 7 Contacts, Pitch 2.54mm, Single Row Through Mount Straight Socket (Lead Length 3.25mm); Manufacturer: SAMTEC; PressFit: No; Author: CERN DEM HF; Part Number: SAMTEC_CES-107-01-L-S; Component Kind: Standard; Component Type: Standard; Pin Count: 7; Family: Socket 7; Mounted: Yes; Socket: No; SMD: No; Sense: No; Status: None; Manufacturer Part Number: CES-107-01-L-S; ComponentHeight: 5.08mm; HelpURL: \\cern.ch\dfs\Applications\Altium\Datasheets\SAMTEC_CES-107-01-T-S.pdf; CreateDate: 25.04.2024; LatestRevisionDate: 25.04.2024

## Nets that join several sheets
GND: CFD_V1.03_Main (8 pins), PWR1 (21 pins), PWR2 (21 pins), PWR3 (21 pins), PWR4 (21 pins), PWR5 (21 pins), PWR6 (21 pins), PWR7 (21 pins), PWR8 (21 pins), PWR9 (21 pins), PWR10 (21 pins), PWR11 (21 pins), PWR12 (21 pins), IN_BUFFER1 (7 pins), IN_BUFFER2 (7 pins), IN_BUFFER3 (7 pins), IN_BUFFER4 (7 pins), IN_BUFFER5 (7 pins), IN_BUFFER6 (7 pins), IN_BUFFER7 (7 pins), IN_BUFFER8 (7 pins), IN_BUFFER9 (7 pins), IN_BUFFER10 (7 pins), IN_BUFFER11 (7 pins), IN_BUFFER12 (7 pins), DIFF_DRV1 (8 pins), DIFF_DRV2 (8 pins), DIFF_DRV3 (8 pins), DIFF_DRV4 (8 pins), DIFF_DRV5 (8 pins), DIFF_DRV6 (8 pins), DIFF_DRV7 (8 pins), DIFF_DRV8 (8 pins), DIFF_DRV9 (8 pins), DIFF_DRV10 (8 pins), DIFF_DRV11 (8 pins), DIFF_DRV12 (8 pins), CFD_T1 (25 pins), CFD_T2 (25 pins), CFD_T3 (25 pins), CFD_T4 (25 pins), CFD_T5 (25 pins), CFD_T6 (25 pins), CFD_T7 (25 pins), CFD_T8 (25 pins), CFD_T9 (25 pins), CFD_T10 (25 pins), CFD_T11 (25 pins), CFD_T12 (25 pins)
N5V5: CFD_V1.03_Main (C21.2 C45.2 C46.2 L4.2), PWR1 (L9A.1), PWR2 (L9B.1), PWR3 (L9C.1), PWR4 (L9D.1), PWR5 (L9E.1), PWR6 (L9F.1), PWR7 (L9G.1), PWR8 (L9H.1), PWR9 (L9I.1), PWR10 (L9J.1), PWR11 (L9K.1), PWR12 (L9L.1)
P5V5: CFD_V1.03_Main (C20.1 C34.1 C44.1 L2.2), PWR1 (L8A.1), PWR2 (L8B.1), PWR3 (L8C.1), PWR4 (L8D.1), PWR5 (L8E.1), PWR6 (L8F.1), PWR7 (L8G.1), PWR8 (L8H.1), PWR9 (L8I.1), PWR10 (L8J.1), PWR11 (L8K.1), PWR12 (L8L.1)
BUFFER_OFFSET: IN_BUFFER1 (C12A.2 DA6A.3 DA20A.3), DIFF_DRV1 (X5A.2)
BUFFER_OFFSET: IN_BUFFER2 (C12B.2 DA6B.3 DA20B.3), DIFF_DRV2 (X5B.2)
BUFFER_OFFSET: IN_BUFFER3 (C12C.2 DA6C.3 DA20C.3), DIFF_DRV3 (X5C.2)
BUFFER_OFFSET: IN_BUFFER4 (C12D.2 DA6D.3 DA20D.3), DIFF_DRV4 (X5D.2)
BUFFER_OFFSET: IN_BUFFER5 (C12E.2 DA6E.3 DA20E.3), DIFF_DRV5 (X5E.2)
BUFFER_OFFSET: IN_BUFFER6 (C12F.2 DA6F.3 DA20F.3), DIFF_DRV6 (X5F.2)
BUFFER_OFFSET: IN_BUFFER7 (C12G.2 DA6G.3 DA20G.3), DIFF_DRV7 (X5G.2)
BUFFER_OFFSET: IN_BUFFER8 (C12H.2 DA6H.3 DA20H.3), DIFF_DRV8 (X5H.2)
BUFFER_OFFSET: IN_BUFFER9 (C12I.2 DA6I.3 DA20I.3), DIFF_DRV9 (X5I.2)
BUFFER_OFFSET: IN_BUFFER10 (C12J.2 DA6J.3 DA20J.3), DIFF_DRV10 (X5J.2)
BUFFER_OFFSET: IN_BUFFER11 (C12K.2 DA6K.3 DA20K.3), DIFF_DRV11 (X5K.2)
BUFFER_OFFSET: IN_BUFFER12 (C12L.2 DA6L.3 DA20L.3), DIFF_DRV12 (X5L.2)
CFD_CMP_OFFSET: DIFF_DRV1 (X5A.4), CFD_T1 (R401A.1)
CFD_CMP_OFFSET: DIFF_DRV2 (X5B.4), CFD_T2 (R401B.1)
CFD_CMP_OFFSET: DIFF_DRV3 (X5C.4), CFD_T3 (R401C.1)
CFD_CMP_OFFSET: DIFF_DRV4 (X5D.4), CFD_T4 (R401D.1)
CFD_CMP_OFFSET: DIFF_DRV5 (X5E.4), CFD_T5 (R401E.1)
CFD_CMP_OFFSET: DIFF_DRV6 (X5F.4), CFD_T6 (R401F.1)
CFD_CMP_OFFSET: DIFF_DRV7 (X5G.4), CFD_T7 (R401G.1)
CFD_CMP_OFFSET: DIFF_DRV8 (X5H.4), CFD_T8 (R401H.1)
CFD_CMP_OFFSET: DIFF_DRV9 (X5I.4), CFD_T9 (R401I.1)
CFD_CMP_OFFSET: DIFF_DRV10 (X5J.4), CFD_T10 (R401J.1)
CFD_CMP_OFFSET: DIFF_DRV11 (X5K.4), CFD_T11 (R401K.1)
CFD_CMP_OFFSET: DIFF_DRV12 (X5L.4), CFD_T12 (R401L.1)
CFD_OFFSET: DIFF_DRV1 (X5A.1), CFD_T1 (C73A.2 R21A.1)
CFD_OFFSET: DIFF_DRV2 (X5B.1), CFD_T2 (C73B.2 R21B.1)
CFD_OFFSET: DIFF_DRV3 (X5C.1), CFD_T3 (C73C.2 R21C.1)
CFD_OFFSET: DIFF_DRV4 (X5D.1), CFD_T4 (C73D.2 R21D.1)
CFD_OFFSET: DIFF_DRV5 (X5E.1), CFD_T5 (C73E.2 R21E.1)
CFD_OFFSET: DIFF_DRV6 (X5F.1), CFD_T6 (C73F.2 R21F.1)
CFD_OFFSET: DIFF_DRV7 (X5G.1), CFD_T7 (C73G.2 R21G.1)
CFD_OFFSET: DIFF_DRV8 (X5H.1), CFD_T8 (C73H.2 R21H.1)
CFD_OFFSET: DIFF_DRV9 (X5I.1), CFD_T9 (C73I.2 R21I.1)
CFD_OFFSET: DIFF_DRV10 (X5J.1), CFD_T10 (C73J.2 R21J.1)
CFD_OFFSET: DIFF_DRV11 (X5K.1), CFD_T11 (C73K.2 R21K.1)
CFD_OFFSET: DIFF_DRV12 (X5L.1), CFD_T12 (C73L.2 R21L.1)
N3V0: PWR1 (C9A.2 DA1A.5), IN_BUFFER1 (C11A.2 DA7A.5 DA7A.9)
N3V0: PWR2 (C9B.2 DA1B.5), IN_BUFFER2 (C11B.2 DA7B.5 DA7B.9)
N3V0: PWR3 (C9C.2 DA1C.5), IN_BUFFER3 (C11C.2 DA7C.5 DA7C.9)
N3V0: PWR4 (C9D.2 DA1D.5), IN_BUFFER4 (C11D.2 DA7D.5 DA7D.9)
N3V0: PWR5 (C9E.2 DA1E.5), IN_BUFFER5 (C11E.2 DA7E.5 DA7E.9)
N3V0: PWR6 (C9F.2 DA1F.5), IN_BUFFER6 (C11F.2 DA7F.5 DA7F.9)
N3V0: PWR7 (C9G.2 DA1G.5), IN_BUFFER7 (C11G.2 DA7G.5 DA7G.9)
N3V0: PWR8 (C9H.2 DA1H.5), IN_BUFFER8 (C11H.2 DA7H.5 DA7H.9)
N3V0: PWR9 (C9I.2 DA1I.5), IN_BUFFER9 (C11I.2 DA7I.5 DA7I.9)
N3V0: PWR10 (C9J.2 DA1J.5), IN_BUFFER10 (C11J.2 DA7J.5 DA7J.9)
N3V0: PWR11 (C9K.2 DA1K.5), IN_BUFFER11 (C11K.2 DA7K.5 DA7K.9)
N3V0: PWR12 (C9L.2 DA1L.5), IN_BUFFER12 (C11L.2 DA7L.5 DA7L.9)
N5V0: PWR1 (C146A.2 DA12A.1 R1A.1), IN_BUFFER1 (DA6A.4 DA20A.4), DIFF_DRV1 (5 pins), CFD_T1 (C38A.2 DA8A.4 L300A.1)
N5V0: PWR2 (C146B.2 DA12B.1 R1B.1), IN_BUFFER2 (DA6B.4 DA20B.4), DIFF_DRV2 (5 pins), CFD_T2 (C38B.2 DA8B.4 L300B.1)
N5V0: PWR3 (C146C.2 DA12C.1 R1C.1), IN_BUFFER3 (DA6C.4 DA20C.4), DIFF_DRV3 (5 pins), CFD_T3 (C38C.2 DA8C.4 L300C.1)
N5V0: PWR4 (C146D.2 DA12D.1 R1D.1), IN_BUFFER4 (DA6D.4 DA20D.4), DIFF_DRV4 (5 pins), CFD_T4 (C38D.2 DA8D.4 L300D.1)
N5V0: PWR5 (C146E.2 DA12E.1 R1E.1), IN_BUFFER5 (DA6E.4 DA20E.4), DIFF_DRV5 (5 pins), CFD_T5 (C38E.2 DA8E.4 L300E.1)
N5V0: PWR6 (C146F.2 DA12F.1 R1F.1), IN_BUFFER6 (DA6F.4 DA20F.4), DIFF_DRV6 (5 pins), CFD_T6 (C38F.2 DA8F.4 L300F.1)
N5V0: PWR7 (C146G.2 DA12G.1 R1G.1), IN_BUFFER7 (DA6G.4 DA20G.4), DIFF_DRV7 (5 pins), CFD_T7 (C38G.2 DA8G.4 L300G.1)
N5V0: PWR8 (C146H.2 DA12H.1 R1H.1), IN_BUFFER8 (DA6H.4 DA20H.4), DIFF_DRV8 (5 pins), CFD_T8 (C38H.2 DA8H.4 L300H.1)
N5V0: PWR9 (C146I.2 DA12I.1 R1I.1), IN_BUFFER9 (DA6I.4 DA20I.4), DIFF_DRV9 (5 pins), CFD_T9 (C38I.2 DA8I.4 L300I.1)
N5V0: PWR10 (C146J.2 DA12J.1 R1J.1), IN_BUFFER10 (DA6J.4 DA20J.4), DIFF_DRV10 (5 pins), CFD_T10 (C38J.2 DA8J.4 L300J.1)
N5V0: PWR11 (C146K.2 DA12K.1 R1K.1), IN_BUFFER11 (DA6K.4 DA20K.4), DIFF_DRV11 (5 pins), CFD_T11 (C38K.2 DA8K.4 L300K.1)
N5V0: PWR12 (C146L.2 DA12L.1 R1L.1), IN_BUFFER12 (DA6L.4 DA20L.4), DIFF_DRV12 (5 pins), CFD_T12 (C38L.2 DA8L.4 L300L.1)
P1V3: PWR1 (C42A.1 DA13A.5 R28A.2), CFD_T1 (12 pins)
P1V3: PWR2 (C42B.1 DA13B.5 R28B.2), CFD_T2 (12 pins)
P1V3: PWR3 (C42C.1 DA13C.5 R28C.2), CFD_T3 (12 pins)
P1V3: PWR4 (C42D.1 DA13D.5 R28D.2), CFD_T4 (12 pins)
P1V3: PWR5 (C42E.1 DA13E.5 R28E.2), CFD_T5 (12 pins)
P1V3: PWR6 (C42F.1 DA13F.5 R28F.2), CFD_T6 (12 pins)
P1V3: PWR7 (C42G.1 DA13G.5 R28G.2), CFD_T7 (12 pins)
P1V3: PWR8 (C42H.1 DA13H.5 R28H.2), CFD_T8 (12 pins)
P1V3: PWR9 (C42I.1 DA13I.5 R28I.2), CFD_T9 (12 pins)
P1V3: PWR10 (C42J.1 DA13J.5 R28J.2), CFD_T10 (12 pins)
P1V3: PWR11 (C42K.1 DA13K.5 R28K.2), CFD_T11 (12 pins)
P1V3: PWR12 (C42L.1 DA13L.5 R28L.2), CFD_T12 (12 pins)
P2V5: PWR1 (C7A.2 DA3A.5), IN_BUFFER1 (C3A.2 DA7A.8)
P2V5: PWR2 (C7B.2 DA3B.5), IN_BUFFER2 (C3B.2 DA7B.8)
P2V5: PWR3 (C7C.2 DA3C.5), IN_BUFFER3 (C3C.2 DA7C.8)
P2V5: PWR4 (C7D.2 DA3D.5), IN_BUFFER4 (C3D.2 DA7D.8)
P2V5: PWR5 (C7E.2 DA3E.5), IN_BUFFER5 (C3E.2 DA7E.8)
P2V5: PWR6 (C7F.2 DA3F.5), IN_BUFFER6 (C3F.2 DA7F.8)
P2V5: PWR7 (C7G.2 DA3G.5), IN_BUFFER7 (C3G.2 DA7G.8)
P2V5: PWR8 (C7H.2 DA3H.5), IN_BUFFER8 (C3H.2 DA7H.8)
P2V5: PWR9 (C7I.2 DA3I.5), IN_BUFFER9 (C3I.2 DA7I.8)
P2V5: PWR10 (C7J.2 DA3J.5), IN_BUFFER10 (C3J.2 DA7J.8)
P2V5: PWR11 (C7K.2 DA3K.5), IN_BUFFER11 (C3K.2 DA7K.8)
P2V5: PWR12 (C7L.2 DA3L.5), IN_BUFFER12 (C3L.2 DA7L.8)
P3V3: PWR1 (C22A.1 C29A.2 DA13A.4 R29A.1), CFD_T1 (14 pins)
P3V3: PWR2 (C22B.1 C29B.2 DA13B.4 R29B.1), CFD_T2 (14 pins)
P3V3: PWR3 (C22C.1 C29C.2 DA13C.4 R29C.1), CFD_T3 (14 pins)
P3V3: PWR4 (C22D.1 C29D.2 DA13D.4 R29D.1), CFD_T4 (14 pins)
P3V3: PWR5 (C22E.1 C29E.2 DA13E.4 R29E.1), CFD_T5 (14 pins)
P3V3: PWR6 (C22F.1 C29F.2 DA13F.4 R29F.1), CFD_T6 (14 pins)
P3V3: PWR7 (C22G.1 C29G.2 DA13G.4 R29G.1), CFD_T7 (14 pins)
P3V3: PWR8 (C22H.1 C29H.2 DA13H.4 R29H.1), CFD_T8 (14 pins)
P3V3: PWR9 (C22I.1 C29I.2 DA13I.4 R29I.1), CFD_T9 (14 pins)
P3V3: PWR10 (C22J.1 C29J.2 DA13J.4 R29J.1), CFD_T10 (14 pins)
P3V3: PWR11 (C22K.1 C29K.2 DA13K.4 R29K.1), CFD_T11 (14 pins)
P3V3: PWR12 (C22L.1 C29L.2 DA13L.4 R29L.1), CFD_T12 (14 pins)
P5V0: PWR1 (C135A.1 DA11A.3 R25A.1), IN_BUFFER1 (DA6A.7 DA20A.7), DIFF_DRV1 (5 pins), CFD_T1 (C30A.2 DA8A.7 L301A.2)
P5V0: PWR2 (C135B.1 DA11B.3 R25B.1), IN_BUFFER2 (DA6B.7 DA20B.7), DIFF_DRV2 (5 pins), CFD_T2 (C30B.2 DA8B.7 L301B.2)
P5V0: PWR3 (C135C.1 DA11C.3 R25C.1), IN_BUFFER3 (DA6C.7 DA20C.7), DIFF_DRV3 (5 pins), CFD_T3 (C30C.2 DA8C.7 L301C.2)
P5V0: PWR4 (C135D.1 DA11D.3 R25D.1), IN_BUFFER4 (DA6D.7 DA20D.7), DIFF_DRV4 (5 pins), CFD_T4 (C30D.2 DA8D.7 L301D.2)
P5V0: PWR5 (C135E.1 DA11E.3 R25E.1), IN_BUFFER5 (DA6E.7 DA20E.7), DIFF_DRV5 (5 pins), CFD_T5 (C30E.2 DA8E.7 L301E.2)
P5V0: PWR6 (C135F.1 DA11F.3 R25F.1), IN_BUFFER6 (DA6F.7 DA20F.7), DIFF_DRV6 (5 pins), CFD_T6 (C30F.2 DA8F.7 L301F.2)
P5V0: PWR7 (C135G.1 DA11G.3 R25G.1), IN_BUFFER7 (DA6G.7 DA20G.7), DIFF_DRV7 (5 pins), CFD_T7 (C30G.2 DA8G.7 L301G.2)
P5V0: PWR8 (C135H.1 DA11H.3 R25H.1), IN_BUFFER8 (DA6H.7 DA20H.7), DIFF_DRV8 (5 pins), CFD_T8 (C30H.2 DA8H.7 L301H.2)
P5V0: PWR9 (C135I.1 DA11I.3 R25I.1), IN_BUFFER9 (DA6I.7 DA20I.7), DIFF_DRV9 (5 pins), CFD_T9 (C30I.2 DA8I.7 L301I.2)
P5V0: PWR10 (C135J.1 DA11J.3 R25J.1), IN_BUFFER10 (DA6J.7 DA20J.7), DIFF_DRV10 (5 pins), CFD_T10 (C30J.2 DA8J.7 L301J.2)
P5V0: PWR11 (C135K.1 DA11K.3 R25K.1), IN_BUFFER11 (DA6K.7 DA20K.7), DIFF_DRV11 (5 pins), CFD_T11 (C30K.2 DA8K.7 L301K.2)
P5V0: PWR12 (C135L.1 DA11L.3 R25L.1), IN_BUFFER12 (DA6L.7 DA20L.7), DIFF_DRV12 (5 pins), CFD_T12 (C30L.2 DA8L.7 L301L.2)
SIG_IN: IN_BUFFER1 (R2A.1 X12A.1), DIFF_DRV1 (R50A.1)
SIG_IN: IN_BUFFER2 (R2B.1 X12B.1), DIFF_DRV2 (R50B.1)
SIG_IN: IN_BUFFER3 (R2C.1 X12C.1), DIFF_DRV3 (R50C.1)
SIG_IN: IN_BUFFER4 (R2D.1 X12D.1), DIFF_DRV4 (R50D.1)
SIG_IN: IN_BUFFER5 (R2E.1 X12E.1), DIFF_DRV5 (R50E.1)
SIG_IN: IN_BUFFER6 (R2F.1 X12F.1), DIFF_DRV6 (R50F.1)
SIG_IN: IN_BUFFER7 (R2G.1 X12G.1), DIFF_DRV7 (R50G.1)
SIG_IN: IN_BUFFER8 (R2H.1 X12H.1), DIFF_DRV8 (R50H.1)
SIG_IN: IN_BUFFER9 (R2I.1 X12I.1), DIFF_DRV9 (R50I.1)
SIG_IN: IN_BUFFER10 (R2J.1 X12J.1), DIFF_DRV10 (R50J.1)
SIG_IN: IN_BUFFER11 (R2K.1 X12K.1), DIFF_DRV11 (R50K.1)
SIG_IN: IN_BUFFER12 (R2L.1 X12L.1), DIFF_DRV12 (R50L.1)
SIG_IN_BUF: IN_BUFFER1 (DA7A.7 R39A.1), CFD_T1 (DA100A.8 DA100A.12 X4A.1)
SIG_IN_BUF: IN_BUFFER2 (DA7B.7 R39B.1), CFD_T2 (DA100B.8 DA100B.12 X4B.1)
SIG_IN_BUF: IN_BUFFER3 (DA7C.7 R39C.1), CFD_T3 (DA100C.8 DA100C.12 X4C.1)
SIG_IN_BUF: IN_BUFFER4 (DA7D.7 R39D.1), CFD_T4 (DA100D.8 DA100D.12 X4D.1)
SIG_IN_BUF: IN_BUFFER5 (DA7E.7 R39E.1), CFD_T5 (DA100E.8 DA100E.12 X4E.1)
SIG_IN_BUF: IN_BUFFER6 (DA7F.7 R39F.1), CFD_T6 (DA100F.8 DA100F.12 X4F.1)
SIG_IN_BUF: IN_BUFFER7 (DA7G.7 R39G.1), CFD_T7 (DA100G.8 DA100G.12 X4G.1)
SIG_IN_BUF: IN_BUFFER8 (DA7H.7 R39H.1), CFD_T8 (DA100H.8 DA100H.12 X4H.1)
SIG_IN_BUF: IN_BUFFER9 (DA7I.7 R39I.1), CFD_T9 (DA100I.8 DA100I.12 X4I.1)
SIG_IN_BUF: IN_BUFFER10 (DA7J.7 R39J.1), CFD_T10 (DA100J.8 DA100J.12 X4J.1)
SIG_IN_BUF: IN_BUFFER11 (DA7K.7 R39K.1), CFD_T11 (DA100K.8 DA100K.12 X4K.1)
SIG_IN_BUF: IN_BUFFER12 (DA7L.7 R39L.1), CFD_T12 (DA100L.8 DA100L.12 X4L.1)